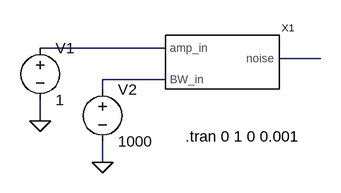
[diagram p0: schematic noise_use.asc]
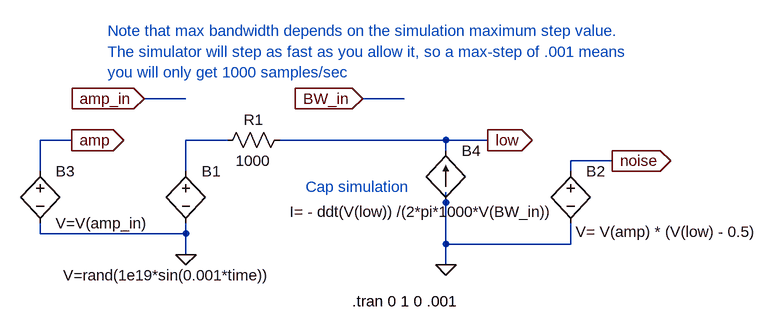
[diagram p1: sub-circuit noise_module.asc]
noise_use.asc, the LTspice schematic file:
Version 4.1
SHEET 1 880 680
WIRE 128 192 -64 192
WIRE 368 208 304 208
WIRE 128 240 32 240
WIRE 32 256 32 240
WIRE -64 304 -64 272
WIRE 32 368 32 336
FLAG -64 304 0
FLAG 32 368 0
SYMBOL noise_module 256 208 R0
SYMATTR InstName X1
SYMBOL voltage -64 176 R0
WINDOW 123 0 0 Left 0
WINDOW 39 0 0 Left 0
SYMATTR InstName V1
SYMATTR Value 1
SYMBOL voltage 32 240 R0
WINDOW 123 0 0 Left 0
WINDOW 39 0 0 Left 0
SYMATTR InstName V2
SYMATTR Value 1000
TEXT 160 328 Left 0 !.tran 0 1 0 0.001

noise_module.asc, the sub-circuit schematic file:
Version 4
SHEET 1 940 680
WIRE -112 0 -176 0
WIRE 224 0 160 0
WIRE -288 64 -336 64
WIRE -48 64 -112 64
WIRE 288 64 32 64
WIRE 352 64 288 64
WIRE 288 80 288 64
WIRE 544 96 480 96
WIRE -336 112 -336 64
WIRE -112 112 -112 64
WIRE 480 112 480 96
WIRE 288 160 288 144
WIRE -336 208 -336 192
WIRE -112 208 -112 192
WIRE -112 208 -336 208
WIRE 288 224 288 160
WIRE 480 224 480 192
WIRE 480 224 288 224
WIRE -112 240 -112 208
WIRE 288 256 288 224
FLAG -112 240 0
FLAG 288 256 0
FLAG 352 64 low
IOPIN 352 64 Out
FLAG 544 96 noise
IOPIN 544 96 Out
FLAG -288 64 amp
IOPIN -288 64 Out
FLAG -176 0 amp_in
IOPIN -176 0 In
FLAG 160 0 BW_in
IOPIN 160 0 In
SYMBOL bv -112 96 R0
WINDOW 3 -189 176 Left 0
SYMATTR Value V=rand(1e19*sin(0.001*time))
SYMATTR InstName B1
SYMBOL res 48 48 R90
WINDOW 0 0 56 VBottom 0
WINDOW 3 32 56 VTop 0
SYMATTR InstName R1
SYMATTR Value 1000
SYMBOL bv 480 96 R0
WINDOW 3 8 109 Left 0
SYMATTR Value V= V(amp) * (V(low) - 0.5)
SYMATTR InstName B2
SYMBOL bv -336 96 R0
SYMATTR InstName B3
SYMATTR Value V=V(amp_in)
SYMBOL bi2 288 80 R0
WINDOW 3 -240 94 Left 0
SYMATTR InstName B4
SYMATTR Value I= - ddt(V(low)) /(2*pi*1000*V(BW_in))
TEXT 144 312 Left 0 !.tran 0 1 0 .001
TEXT 72 136 Left 0 ;Cap simulation
TEXT -232 -104 Left 0 ;Note that max bandwidth depends on the simulation maximum step value.
TEXT -232 -72 Left 0 ;The simulator will step as fast as you allow it, so a max-step of .001 means\nyou will only get 1000 samples/sec

The netlist it stands for:
* noise_use.asc
X§X1 N001 N003 N002 noise_module
V1 N001 0 1
V2 N003 0 1000

* block symbol definitions
.subckt noise_module amp_in BW_in noise
B1 N001 0 V=rand(1e19*sin(0.001*time))
R1 low N001 1000
B2 noise 0 V= V(amp) * (V(low) - 0.5)
B3 amp 0 V=V(amp_in)
B4 0 low I= - ddt(V(low)) /(2*pi*1000*V(BW_in))
.tran 0 1 0 .001
* Cap simulation
* Note that max bandwidth depends on the simulation maximum step value.
* The simulator will step as fast as you allow it, so a max-step of .001 means
* you will only get 1000 samples/sec
.ends noise_module

.tran 0 1 0 0.001
.backanno
.end